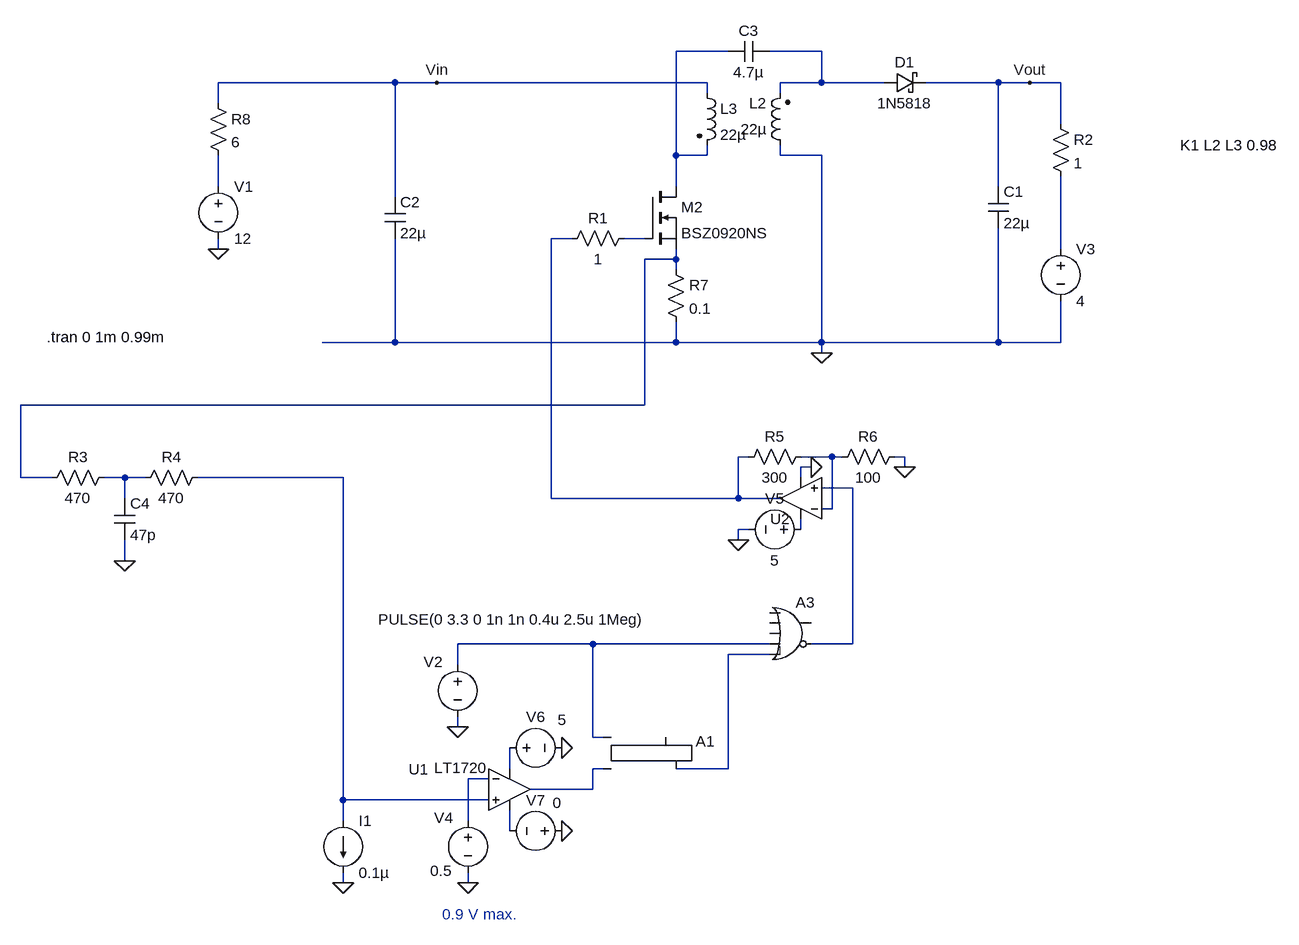
[diagram p0: schematic sepic2.asc]
sepic2.asc, the LTspice schematic file:
Version 4
SHEET 1 1192 1024
WIRE 320 -320 240 -320
WIRE 464 -320 384 -320
WIRE -192 -272 -464 -272
WIRE -128 -272 -192 -272
WIRE 288 -272 -128 -272
WIRE 464 -272 464 -320
WIRE 464 -272 400 -272
WIRE 560 -272 464 -272
WIRE 736 -272 624 -272
WIRE 784 -272 736 -272
WIRE 832 -272 784 -272
WIRE 288 -256 288 -272
WIRE 400 -256 400 -272
WIRE -464 -240 -464 -272
WIRE 832 -208 832 -272
WIRE 240 -160 240 -320
WIRE 288 -160 288 -176
WIRE 288 -160 240 -160
WIRE 400 -160 400 -176
WIRE 464 -160 400 -160
WIRE -464 -112 -464 -160
WIRE 240 -112 240 -160
WIRE 736 -112 736 -272
WIRE -192 -96 -192 -272
WIRE 80 -32 48 -32
WIRE 192 -32 160 -32
WIRE -464 -16 -464 -32
WIRE 832 -16 832 -128
WIRE 240 0 240 -16
WIRE 240 0 192 0
WIRE 240 16 240 0
WIRE -192 128 -192 -32
WIRE -192 128 -304 128
WIRE 240 128 240 96
WIRE 240 128 -192 128
WIRE 464 128 464 -160
WIRE 464 128 240 128
WIRE 736 128 736 -48
WIRE 736 128 464 128
WIRE 832 128 832 64
WIRE 832 128 736 128
WIRE 464 144 464 128
WIRE 192 224 192 0
WIRE 192 224 -768 224
WIRE 352 304 336 304
WIRE 480 304 432 304
WIRE 496 304 480 304
WIRE 592 304 576 304
WIRE 448 320 432 320
WIRE 592 320 592 304
WIRE -768 336 -768 224
WIRE -720 336 -768 336
WIRE -608 336 -640 336
WIRE -576 336 -608 336
WIRE -272 336 -496 336
WIRE 432 336 432 320
WIRE 512 352 464 352
WIRE -608 368 -608 336
WIRE 48 368 48 -32
WIRE 336 368 336 304
WIRE 336 368 48 368
WIRE 400 368 336 368
WIRE 480 384 480 304
WIRE 480 384 464 384
WIRE 352 416 336 416
WIRE 432 416 432 400
WIRE 336 432 336 416
WIRE -608 464 -608 432
WIRE 112 592 -96 592
WIRE 384 592 112 592
WIRE 512 592 512 352
WIRE 512 592 448 592
WIRE 384 608 320 608
WIRE -96 624 -96 592
WIRE -96 720 -96 704
WIRE 112 736 112 592
WIRE 128 736 112 736
WIRE -16 784 -16 752
WIRE 128 784 112 784
WIRE 320 784 320 608
WIRE 320 784 240 784
WIRE -48 800 -80 800
WIRE 112 816 112 784
WIRE 112 816 16 816
WIRE -272 832 -272 336
WIRE -48 832 -272 832
WIRE -272 864 -272 832
WIRE -80 864 -80 800
WIRE -16 880 -16 848
WIRE -272 960 -272 944
WIRE -80 960 -80 944
FLAG -96 720 0
FLAG -128 -272 Vin
FLAG 784 -272 Vout
FLAG 464 144 0
FLAG -80 960 0
FLAG -608 464 0
FLAG 592 320 0
FLAG 336 432 0
FLAG 448 320 0
FLAG -272 960 0
FLAG 64 752 0
FLAG 64 880 0
FLAG -464 -16 0
SYMBOL schottky 560 -256 R270
WINDOW 0 32 32 VTop 2
WINDOW 3 0 32 VBottom 2
SYMATTR InstName D1
SYMATTR Value 1N5818
SYMATTR Description Diode
SYMATTR Type diode
SYMBOL voltage -96 608 R0
WINDOW 0 -52 12 Left 2
WINDOW 3 -122 -54 Left 2
WINDOW 123 0 0 Left 2
WINDOW 39 0 0 Left 2
SYMATTR InstName V2
SYMATTR Value PULSE(0 3.3 0 1n 1n 0.4u 2.5u 1Meg)
SYMBOL nmos 192 -112 R0
SYMATTR InstName M2
SYMATTR Value BSZ0920NS
SYMBOL ind2 416 -160 R180
WINDOW 0 36 80 Left 2
WINDOW 3 36 40 Left 2
SYMATTR InstName L2
SYMATTR Value 22µ
SYMATTR Type ind
SYMBOL ind2 272 -272 R0
SYMATTR InstName L3
SYMATTR Value 22µ
SYMATTR Type ind
SYMBOL cap 384 -336 R90
WINDOW 0 0 32 VBottom 2
WINDOW 3 32 32 VTop 2
SYMATTR InstName C3
SYMATTR Value 4.7µ
SYMBOL res 224 0 R0
SYMATTR InstName R7
SYMATTR Value 0.1
SYMBOL res 176 -48 R90
WINDOW 0 0 56 VBottom 2
WINDOW 3 32 56 VTop 2
SYMATTR InstName R1
SYMATTR Value 1
SYMBOL cap 720 -112 R0
SYMATTR InstName C1
SYMATTR Value 22µ
SYMBOL cap -208 -96 R0
SYMATTR InstName C2
SYMATTR Value 22µ
SYMBOL res 816 -224 R0
SYMATTR InstName R2
SYMATTR Value 1
SYMBOL Digital\\srflop 176 688 R0
SYMATTR InstName A1
SYMBOL Digital\\or 416 512 R0
SYMATTR InstName A3
SYMBOL voltage -80 848 R0
WINDOW 0 -52 12 Left 2
WINDOW 3 -58 93 Left 2
WINDOW 123 0 0 Left 2
WINDOW 39 0 0 Left 2
SYMATTR InstName V4
SYMATTR Value 0.5
SYMBOL res -624 320 R90
WINDOW 0 0 56 VBottom 2
WINDOW 3 32 56 VTop 2
SYMATTR InstName R3
SYMATTR Value 470
SYMBOL res -480 320 R90
WINDOW 0 0 56 VBottom 2
WINDOW 3 32 56 VTop 2
SYMATTR InstName R4
SYMATTR Value 470
SYMBOL cap -624 368 R0
SYMATTR InstName C4
SYMATTR Value 47p
SYMBOL res 336 320 R270
WINDOW 0 32 56 VTop 2
WINDOW 3 0 56 VBottom 2
SYMATTR InstName R5
SYMATTR Value 300
SYMBOL res 480 320 R270
WINDOW 0 32 56 VTop 2
WINDOW 3 0 56 VBottom 2
SYMATTR InstName R6
SYMATTR Value 100
SYMBOL Opamps\\UniversalOpamp2 432 368 R180
SYMATTR InstName U2
SYMATTR SpiceModel level.1
SYMATTR SpiceLine ilimit=2500 rail=0 Vos=0 phimargin=45
SYMBOL voltage 448 416 R90
WINDOW 0 -32 56 VBottom 2
WINDOW 3 32 56 VTop 2
WINDOW 123 0 0 Left 2
WINDOW 39 0 0 Left 2
SYMATTR InstName V5
SYMATTR Value 5
SYMBOL current -272 864 R0
WINDOW 123 0 0 Left 2
WINDOW 39 0 0 Left 2
SYMATTR InstName I1
SYMATTR Value 0.1µ
SYMBOL voltage -32 752 R270
WINDOW 0 32 56 VTop 2
WINDOW 3 59 97 VBottom 2
WINDOW 123 0 0 Left 2
WINDOW 39 0 0 Left 2
SYMATTR InstName V6
SYMATTR Value 5
SYMBOL voltage 80 880 R90
WINDOW 0 -32 56 VBottom 2
WINDOW 3 -59 23 VTop 2
WINDOW 123 0 0 Left 2
WINDOW 39 0 0 Left 2
SYMATTR InstName V7
SYMATTR Value 0
SYMBOL Comparators\\LT1720 -16 752 R0
WINDOW 0 -155 33 Left 2
WINDOW 3 -116 31 Left 2
SYMATTR InstName U1
SYMBOL voltage -464 -128 R0
WINDOW 123 0 0 Left 2
WINDOW 39 0 0 Left 2
SYMATTR InstName V1
SYMATTR Value 12
SYMBOL res -480 -256 R0
SYMATTR InstName R8
SYMATTR Value 6
SYMBOL voltage 832 -32 R0
WINDOW 123 0 0 Left 2
WINDOW 39 0 0 Left 2
SYMATTR InstName V3
SYMATTR Value 4
TEXT -728 120 Left 2 !.tran 0 1m 0.99m
TEXT 1016 -176 Left 2 !K1 L2 L3 0.98
TEXT -120 1008 Left 2 ;0.9 V max.

The netlist it stands for:
* sepic2.asc
D1 N002 Vout 1N5818
V2 N013 0 PULSE(0 3.3 0 1n 1n 0.4u 2.5u 1Meg)
M2 N001 N005 N007 N007 BSZ0920NS
L2 0 N002 22µ
L3 Vin N001 22µ
C3 N002 N001 4.7µ
R7 N007 0 0.1
R1 N005 N004 1
C1 Vout 0 22µ
C2 Vin 0 22µ
R2 Vout N006 1
A1 N013 N016 0 0 0 N014 0 0 SRFLOP
A3 0 0 0 N013 N014 N011 0 0 OR
V4 N017 0 0.5
R3 N009 N007 470
R4 N010 N009 470
C4 N009 0 47p
R5 N004 N008 300
R6 N008 0 100
XU2 N011 N008 N012 0 N004 level.1 Avol=1Meg GBW=10Meg Slew=10Meg ilimit=2500 rail=0 Vos=0 phimargin=45 en=0 enk=0 in=0 ink=0 Rin=500Meg  ; pins IN+ IN- V+ V- OUT
V5 N012 0 5
I1 N010 0 0.1µ
V6 N015 0 5
V7 0 N018 0
XU1 N010 N017 N015 N018 N016 LT1720  ; pins In+ In- V+ V- OUT
V1 N003 0 12
R8 Vin N003 6
V3 N006 0 4
.model D D
.lib standard.dio
.model NMOS NMOS
.model PMOS PMOS
.lib standard.mos
.tran 0 1m 0.99m
K1 L2 L3 0.98
* 0.9 V max.
.lib UniversalOpamps2.sub
.lib LT1720.sub
.backanno
.end